# Altium project FET_Gate_Drive_Breakout.PrjPcb
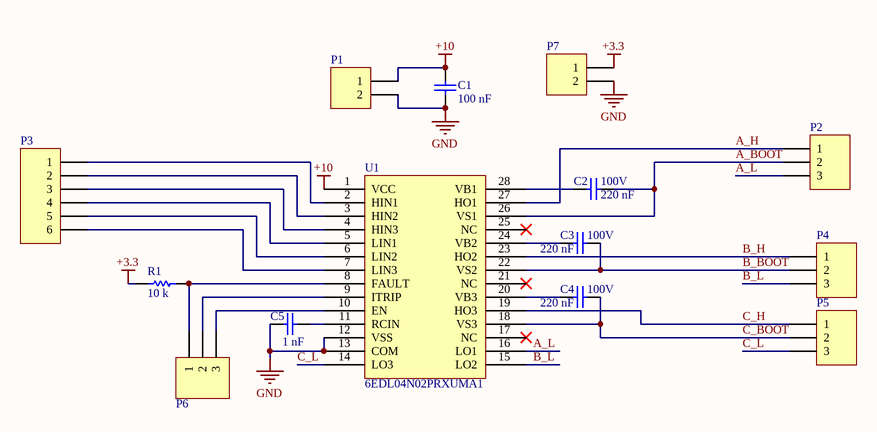
[diagram p0: FET_Gate_Drive_Breakout.SchDoc]
1 sheet, 14 parts. Net scope: global (net labels, ports and power ports of the same name join across sheets).
Board file: FET_Gate_Drive_Breakout.PcbDoc

## Sheet FET_Gate_Drive_Breakout.SchDoc
size A4; Organization: Waterloop; Address1: 200 University Ave W; Address2: Engineering 5, 1104; Address3: Waterloo, ON; Address4: N2L 3G1

### Parts
C1  value 100 nF  [0805 - Capacitor]  (hidden comment: Capacitor - Nonpolarized)
C2  value 220 nF  Rating: 100V  [0805 - Capacitor]  (hidden comment: Capacitor - Nonpolarized)
C3  value 220 nF  Rating: 100V  [0805 - Capacitor]  (hidden comment: Capacitor - Nonpolarized)
C4  value 220 nF  Rating: 100V  [0805 - Capacitor]  (hidden comment: Capacitor - Nonpolarized)
C5  value 1 nF  [0805 - Capacitor]  (hidden comment: Capacitor - Nonpolarized)
P1  1x2 Header  [HDR1X2]  (value not drawn)
P2  1x3 Header  [HDR1X3]  (value not drawn)
P3  1x6 Header  [HDR1X6]  (value not drawn)
P4  1x3 Header  [HDR1X3]  (value not drawn)
P5  1x3 Header  [HDR1X3]  (value not drawn)
P6  1x3 Header  [HDR1X3]  (value not drawn)
P7  1x2 Header  [HDR1X2]  (value not drawn)
R1  value 10 k  [0603 - Resistor]  (hidden comment: Resistor)
U1  6EDL04N02PRXUMA1  [TSOP65P640X120-28N]

### Nets
+3.3: P7.1 R1.2
+10: C1.1 P1.1 U1.1(VCC)
GND: C1.2 C5.1 P1.2 P7.2 U1.12(VSS) U1.13(COM)
A_BOOT: C2.2 P2.2 U1.26(VS1)
A_H: P2.1 U1.27(HO1)
A_L: P2.3 U1.16(LO1)
B_BOOT: C3.2 P4.2 U1.22(VS2)
B_H: P4.1 U1.23(HO2)
B_L: P4.3 U1.15(LO2)
C_BOOT: C4.2 P5.2 U1.18(VS3)
C_H: P5.1 U1.19(HO3)
C_L: P5.3 U1.14(LO3)
NetC2_1: C2.1 U1.28(VB1)
NetC3_1: C3.1 U1.24(VB2)
NetC4_1: C4.1 U1.20(VB3)
NetC5_2: C5.2 U1.11(RCIN)
NetP3_1: P3.1 U1.2(HIN1)
NetP3_2: P3.2 U1.3(HIN2)
NetP3_3: P3.3 U1.4(HIN3)
NetP3_4: P3.4 U1.5(LIN1)
NetP3_5: P3.5 U1.6(LIN2)
NetP3_6: P3.6 U1.7(LIN3)
NetP6_1: P6.1 R1.1 U1.8(FAULT)
NetP6_2: P6.2 U1.9(ITRIP)
NetP6_3: P6.3 U1.10(EN)

Not connected (* = marked no-connect by the designer): U1 17(NC)* 21(NC)* 25(NC)*

### Notes on the sheet
- Title:
- Size:
- Date:
- A4
- Author:
- Revision:
- Sheet
- of
- File:

### Library data of the parts
C1 = Capacitor - Nonpolarized: Nonpolarized Capacitor; Manufacturer: Yageo; Manufacturer Part Number: CC0805KRX7R9BB104; Supplier Part Number: 311-1140-1-ND; Supplier: *; Rating: *
C2-C4 = Capacitor - Nonpolarized: Nonpolarized Capacitor; Manufacturer: Yageo; Manufacturer Part Number: CC0805KKX7R0BB224; Supplier Part Number: 311-1874-1-ND; Supplier: *
C5 = Capacitor - Nonpolarized: Nonpolarized Capacitor; Manufacturer: Yageo; Manufacturer Part Number: CC0805KRX7R9BB102; Supplier Part Number: 311-1127-1-ND; Supplier: *
P1 P7 = 1x2 Header: 1x2 Pin Header
P2 P4-P6 = 1x3 Header: 1x3 Pin Header
P3 = 1x6 Header: 1x6 Pin Header
R1 = Resistor: Manufacturer Part Number: ESR03EZPJ103; Manufacturer: ROHM; Rating: *; Supplier Part Number: RHM10KDCT-ND; Supplier: *
U1 = 6EDL04N02PRXUMA1: 200V Three Phase Gate Driver; Manufacturer: Infineon; Datasheet: https://www.infineon.com/dgdl/6ED2-DB-Rev2_3.pdf?folderId=db3a30431a5c32f2011a77fa27a86cb5&fileId=db3a304336797ff901367c18c18445af; Manufacturer Part Number: 6EDL04N02PRXUMA1; Digikey Part Number: 6EDL04N02PRXUMA1CT-ND